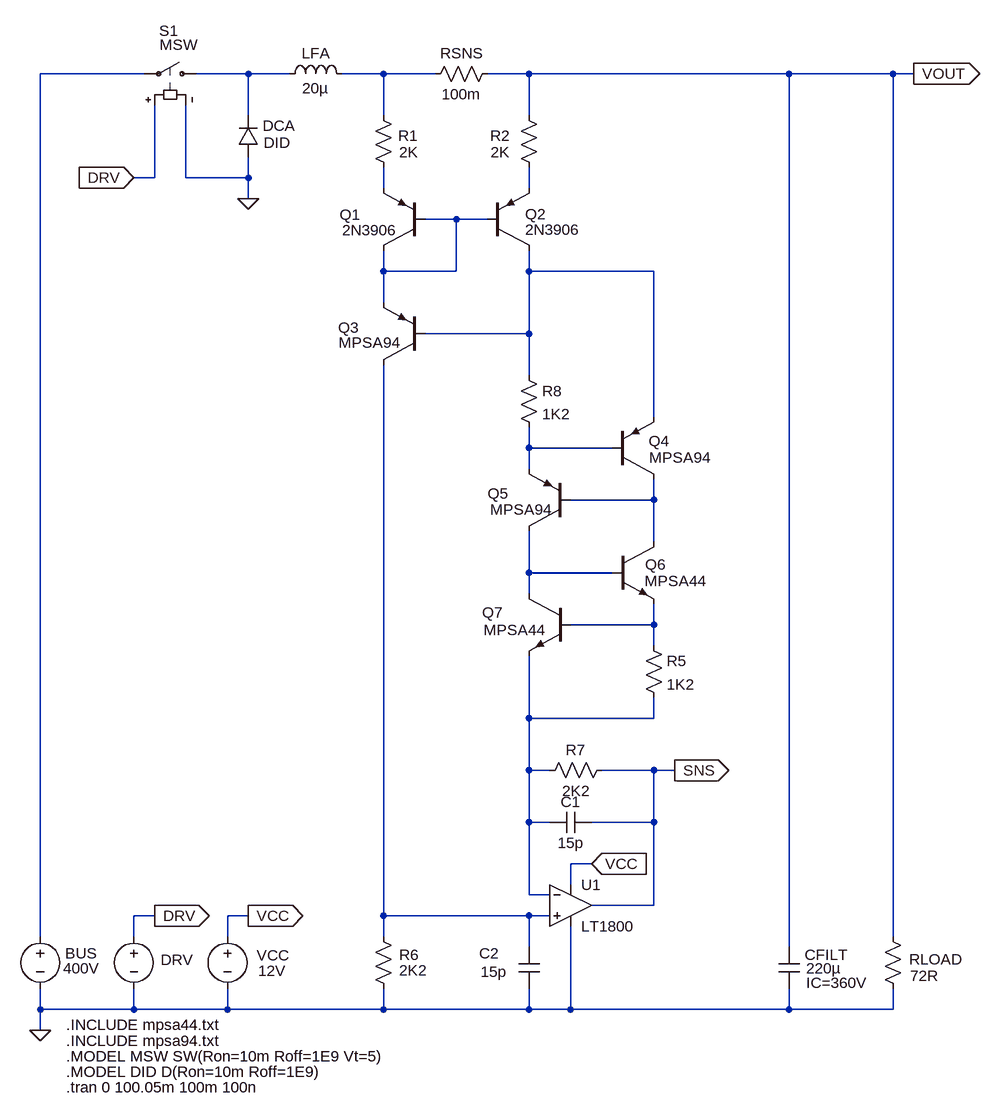
[diagram p0: schematic isense01.asc]
isense01.asc, the LTspice schematic file:
Version 4
SHEET 1 1276 1032
WIRE -32 -624 -192 -624
WIRE 128 -624 48 -624
WIRE 192 -624 128 -624
WIRE 336 -624 272 -624
WIRE 416 -624 336 -624
WIRE 560 -624 496 -624
WIRE 960 -624 560 -624
WIRE 1120 -624 960 -624
WIRE 1152 -624 1120 -624
WIRE 128 -560 128 -624
WIRE 336 -560 336 -624
WIRE 560 -560 560 -624
WIRE -16 -464 -16 -576
WIRE -16 -464 -48 -464
WIRE 32 -464 32 -576
WIRE 128 -464 128 -496
WIRE 128 -464 32 -464
WIRE 336 -448 336 -480
WIRE 560 -448 560 -480
WIRE 128 -432 128 -464
WIRE 448 -400 400 -400
WIRE 496 -400 448 -400
WIRE 336 -320 336 -352
WIRE 448 -320 448 -400
WIRE 448 -320 336 -320
WIRE 560 -320 560 -352
WIRE 752 -320 560 -320
WIRE 336 -272 336 -320
WIRE 560 -224 560 -320
WIRE 560 -224 400 -224
WIRE 560 -160 560 -224
WIRE 752 -96 752 -320
WIRE 560 -48 560 -80
WIRE 688 -48 560 -48
WIRE 560 -16 560 -48
WIRE 752 32 752 0
WIRE 752 32 624 32
WIRE 752 96 752 32
WIRE 560 144 560 80
WIRE 688 144 560 144
WIRE 560 176 560 144
WIRE 752 224 752 192
WIRE 752 224 624 224
WIRE 752 256 752 224
WIRE 560 368 560 272
WIRE 752 368 752 336
WIRE 752 368 560 368
WIRE 560 448 560 368
WIRE 592 448 560 448
WIRE 752 448 672 448
WIRE 784 448 752 448
WIRE 560 528 560 448
WIRE 592 528 560 528
WIRE 752 528 752 448
WIRE 752 528 656 528
WIRE 656 592 624 592
WIRE 624 624 624 592
WIRE 560 640 560 528
WIRE 592 640 560 640
WIRE 752 656 752 528
WIRE 752 656 656 656
WIRE -16 672 -48 672
WIRE 128 672 96 672
WIRE 336 672 336 -176
WIRE 560 672 336 672
WIRE 592 672 560 672
WIRE -192 704 -192 -624
WIRE -48 704 -48 672
WIRE 96 704 96 672
WIRE 336 704 336 672
WIRE 1120 704 1120 -624
WIRE 560 720 560 672
WIRE 960 720 960 -624
WIRE -192 816 -192 784
WIRE -48 816 -48 784
WIRE -48 816 -192 816
WIRE 96 816 96 784
WIRE 96 816 -48 816
WIRE 336 816 336 784
WIRE 336 816 96 816
WIRE 560 816 560 784
WIRE 560 816 336 816
WIRE 624 816 624 688
WIRE 624 816 560 816
WIRE 960 816 960 784
WIRE 960 816 624 816
WIRE 1120 816 1120 784
WIRE 1120 816 960 816
WIRE -192 848 -192 816
FLAG -48 -464 DRV
IOPIN -48 -464 In
FLAG 784 448 SNS
IOPIN 784 448 Out
FLAG -192 848 0
FLAG -16 672 DRV
IOPIN -16 672 Out
FLAG 128 -432 0
FLAG 1152 -624 VOUT
IOPIN 1152 -624 Out
FLAG 656 592 VCC
IOPIN 656 592 In
FLAG 128 672 VCC
IOPIN 128 672 Out
SYMBOL ind 176 -608 R270
WINDOW 0 32 56 VTop 2
WINDOW 3 -22 55 VTop 2
SYMATTR InstName LFA
SYMATTR Value 20µ
SYMBOL res 512 -640 R90
WINDOW 0 0 56 VBottom 2
WINDOW 3 32 56 VTop 2
SYMATTR InstName RSNS
SYMATTR Value 100m
SYMBOL res 320 -576 R0
WINDOW 0 39 47 Left 2
WINDOW 3 40 73 Left 2
SYMATTR InstName R1
SYMATTR Value 2K
SYMBOL res 544 -576 R0
WINDOW 0 -44 47 Left 2
WINDOW 3 -43 73 Left 2
SYMATTR InstName R2
SYMATTR Value 2K
SYMBOL pnp 400 -352 R180
WINDOW 0 99 55 Left 2
WINDOW 3 43 31 Left 2
SYMATTR InstName Q1
SYMATTR Value 2N3906
SYMBOL pnp 496 -352 M180
WINDOW 0 58 56 Left 2
WINDOW 3 58 32 Left 2
SYMATTR InstName Q2
SYMATTR Value 2N3906
SYMBOL cap 944 720 R0
WINDOW 0 40 12 Left 2
WINDOW 3 42 33 Left 2
WINDOW 123 42 55 Left 2
SYMATTR InstName CFILT
SYMATTR Value 220µ
SYMATTR Value2 IC=360V
SYMBOL res 320 688 R0
WINDOW 0 40 44 Left 2
WINDOW 3 40 68 Left 2
SYMATTR InstName R6
SYMATTR Value 2K2
SYMBOL res 688 432 R90
WINDOW 0 0 56 VBottom 2
WINDOW 3 32 56 VTop 2
SYMATTR InstName R7
SYMATTR Value 2K2
SYMBOL sw 64 -624 M270
WINDOW 0 66 73 VLeft 2
WINDOW 3 45 72 VLeft 2
SYMATTR InstName S1
SYMATTR Value MSW
SYMBOL voltage -192 688 R0
WINDOW 0 38 42 Left 2
WINDOW 3 35 65 Left 2
WINDOW 123 0 0 Left 0
WINDOW 39 0 0 Left 0
SYMATTR InstName BUS
SYMATTR Value 400V
SYMBOL voltage -48 688 R0
WINDOW 0 41 52 Left 2
WINDOW 3 24 96 Invisible 2
WINDOW 123 0 0 Left 0
WINDOW 39 0 0 Left 0
SYMATTR InstName DRV
SYMATTR Value PULSE(0 12 0 10n 10n 9u 10u)
SYMBOL res 1104 688 R0
WINDOW 0 41 51 Left 2
WINDOW 3 42 76 Left 2
SYMATTR InstName RLOAD
SYMATTR Value 72R
SYMBOL diode 112 -496 M180
WINDOW 0 38 48 Left 2
WINDOW 3 40 22 Left 2
SYMATTR InstName DCA
SYMATTR Value DID
SYMBOL npn 624 176 M0
WINDOW 0 104 29 Left 2
WINDOW 3 39 56 Left 2
SYMATTR InstName Q7
SYMATTR Value MPSA44
SYMBOL res 544 -176 R0
SYMATTR InstName R8
SYMATTR Value 1K2
SYMBOL res 736 240 R0
SYMATTR InstName R5
SYMATTR Value 1K2
SYMBOL pnp 400 -176 R180
WINDOW 0 101 57 Left 2
WINDOW 3 38 34 Left 2
SYMATTR InstName Q3
SYMATTR Value MPSA94
SYMBOL Opamps\\LT1800 624 592 R0
SYMATTR InstName U1
SYMBOL voltage 96 688 R0
WINDOW 0 45 45 Left 2
WINDOW 3 47 69 Left 2
SYMATTR InstName VCC
SYMATTR Value 12V
SYMBOL cap 656 512 R90
WINDOW 0 0 32 VBottom 2
WINDOW 3 32 32 VTop 2
SYMATTR InstName C1
SYMATTR Value 15p
SYMBOL cap 576 784 R180
WINDOW 0 62 54 Left 2
WINDOW 3 50 26 Left 2
SYMATTR InstName C2
SYMATTR Value 15p
SYMBOL pnp 624 80 R180
WINDOW 0 95 58 Left 2
WINDOW 3 29 33 Left 2
SYMATTR InstName Q5
SYMATTR Value MPSA94
SYMBOL pnp 688 0 M180
WINDOW 0 56 59 Left 2
WINDOW 3 57 33 Left 2
SYMATTR InstName Q4
SYMATTR Value MPSA94
SYMBOL npn 688 96 R0
WINDOW 0 51 35 Left 2
WINDOW 3 50 61 Left 2
SYMATTR InstName Q6
SYMATTR Value MPSA44
TEXT -152 888 Left 2 !.MODEL MSW SW(Ron=10m Roff=1E9 Vt=5)
TEXT -152 912 Left 2 !.MODEL DID D(Ron=10m Roff=1E9)
TEXT -152 936 Left 2 !.tran 0 100.05m 100m 100n
TEXT -152 840 Left 2 !.INCLUDE mpsa44.txt
TEXT -152 864 Left 2 !.INCLUDE mpsa94.txt

The netlist it stands for:
* isense01.asc
LFA N002 N003 20µ
RSNS VOUT N003 100m
R1 N003 N004 2K
R2 VOUT N005 2K
Q1 N006 N006 N004 0 2N3906
Q2 N007 N006 N005 0 2N3906
CFILT VOUT 0 220µ IC=360V
R6 N013 0 2K2
R7 SNS N012 2K2
S1 N002 N001 DRV 0 MSW
V§BUS N001 0 400V
V§DRV DRV 0 PULSE(0 12 0 10n 10n 9u 10u)
RLOAD VOUT 0 72R
DCA 0 N002 DID
Q7 N010 N011 N012 0 MPSA44
R8 N007 N008 1K2
R5 N011 N012 1K2
Q3 N013 N007 N006 0 MPSA94
XU1 N013 N012 VCC 0 SNS LT1800  ; pins In+ In- V+ V- OUT
VCC VCC 0 12V
C1 SNS N012 15p
C2 0 N013 15p
Q5 N010 N009 N008 0 MPSA94
Q4 N009 N008 N007 0 MPSA94
Q6 N009 N010 N011 0 MPSA44
.model D D
.lib standard.dio
.model NPN NPN
.model PNP PNP
.lib standard.bjt
.MODEL MSW SW(Ron=10m Roff=1E9 Vt=5)
.MODEL DID D(Ron=10m Roff=1E9)
.tran 0 100.05m 100m 100n
.INCLUDE mpsa44.txt
.INCLUDE mpsa94.txt
.backanno
.end